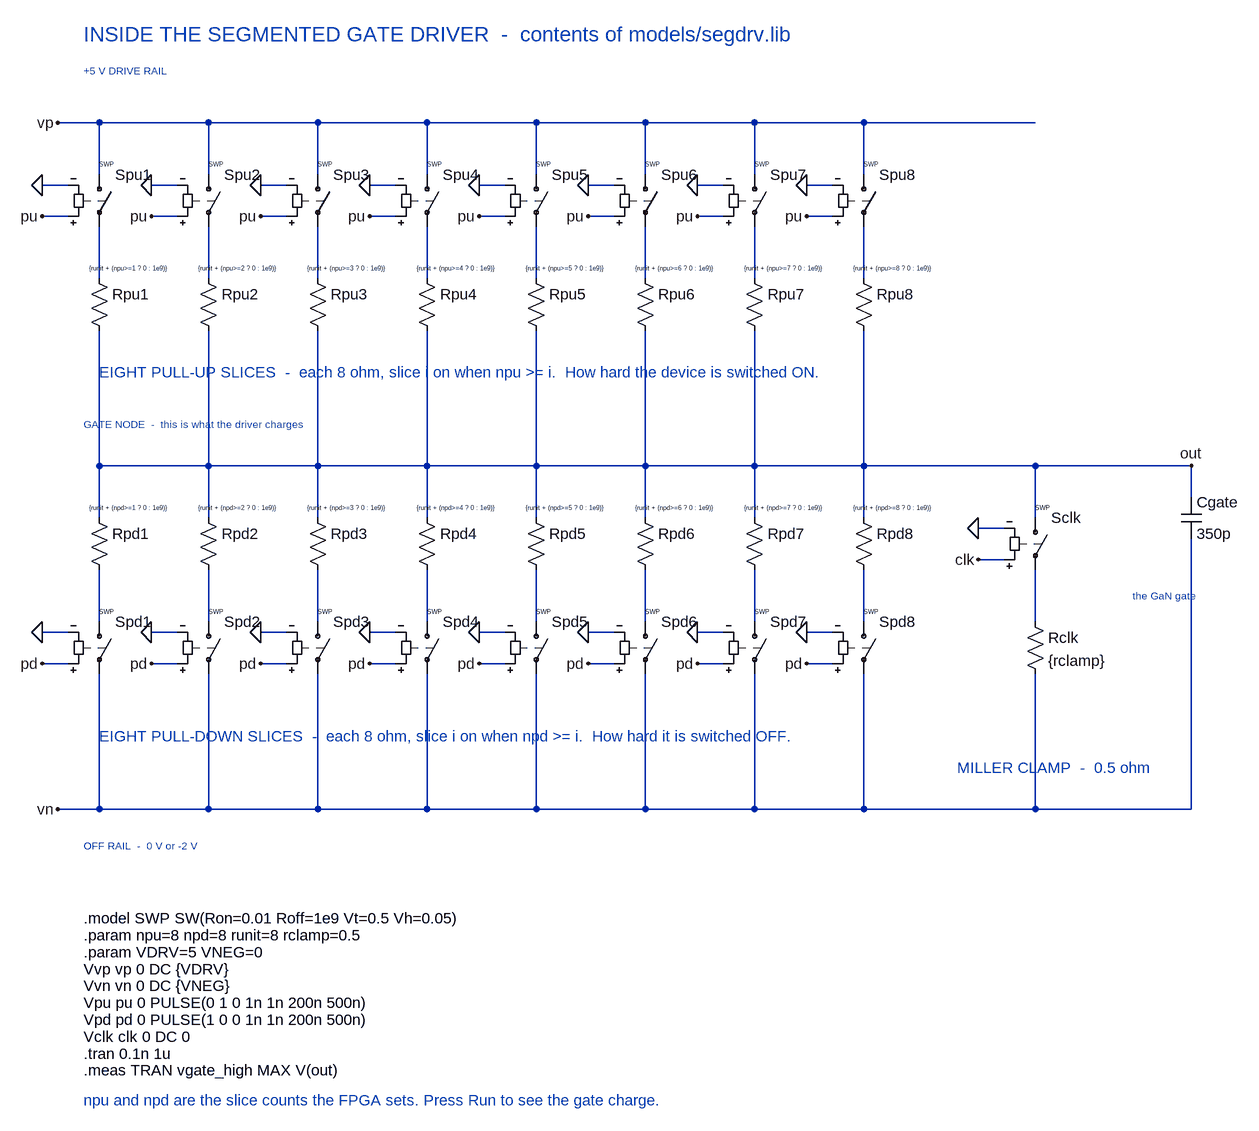
[diagram p0: schematic SEGDRV_inside.asc]
SEGDRV_inside.asc, the LTspice schematic file:
Version 4
SHEET 1 2600 1800
SYMBOL sw 224 240 R0
WINDOW 3 0 0 Left 0
SYMATTR InstName Spu1
SYMATTR Value SWP
SYMBOL res 208 400 R0
WINDOW 3 0 0 Left 0
SYMATTR InstName Rpu1
SYMATTR Value {runit + (npu>=1 ? 0 : 1e9)}
WIRE 224 176 224 256
WIRE 224 336 224 416
WIRE 224 496 224 704
WIRE 176 320 136 320
FLAG 136 320 pu
WIRE 176 272 136 272
FLAG 136 272 0
SYMBOL sw 392 240 R0
WINDOW 3 0 0 Left 0
SYMATTR InstName Spu2
SYMATTR Value SWP
SYMBOL res 376 400 R0
WINDOW 3 0 0 Left 0
SYMATTR InstName Rpu2
SYMATTR Value {runit + (npu>=2 ? 0 : 1e9)}
WIRE 392 176 392 256
WIRE 392 336 392 416
WIRE 392 496 392 704
WIRE 344 320 304 320
FLAG 304 320 pu
WIRE 344 272 304 272
FLAG 304 272 0
SYMBOL sw 560 240 R0
WINDOW 3 0 0 Left 0
SYMATTR InstName Spu3
SYMATTR Value SWP
SYMBOL res 544 400 R0
WINDOW 3 0 0 Left 0
SYMATTR InstName Rpu3
SYMATTR Value {runit + (npu>=3 ? 0 : 1e9)}
WIRE 560 176 560 256
WIRE 560 336 560 416
WIRE 560 496 560 704
WIRE 512 320 472 320
FLAG 472 320 pu
WIRE 512 272 472 272
FLAG 472 272 0
SYMBOL sw 728 240 R0
WINDOW 3 0 0 Left 0
SYMATTR InstName Spu4
SYMATTR Value SWP
SYMBOL res 712 400 R0
WINDOW 3 0 0 Left 0
SYMATTR InstName Rpu4
SYMATTR Value {runit + (npu>=4 ? 0 : 1e9)}
WIRE 728 176 728 256
WIRE 728 336 728 416
WIRE 728 496 728 704
WIRE 680 320 640 320
FLAG 640 320 pu
WIRE 680 272 640 272
FLAG 640 272 0
SYMBOL sw 896 240 R0
WINDOW 3 0 0 Left 0
SYMATTR InstName Spu5
SYMATTR Value SWP
SYMBOL res 880 400 R0
WINDOW 3 0 0 Left 0
SYMATTR InstName Rpu5
SYMATTR Value {runit + (npu>=5 ? 0 : 1e9)}
WIRE 896 176 896 256
WIRE 896 336 896 416
WIRE 896 496 896 704
WIRE 848 320 808 320
FLAG 808 320 pu
WIRE 848 272 808 272
FLAG 808 272 0
SYMBOL sw 1064 240 R0
WINDOW 3 0 0 Left 0
SYMATTR InstName Spu6
SYMATTR Value SWP
SYMBOL res 1048 400 R0
WINDOW 3 0 0 Left 0
SYMATTR InstName Rpu6
SYMATTR Value {runit + (npu>=6 ? 0 : 1e9)}
WIRE 1064 176 1064 256
WIRE 1064 336 1064 416
WIRE 1064 496 1064 704
WIRE 1016 320 976 320
FLAG 976 320 pu
WIRE 1016 272 976 272
FLAG 976 272 0
SYMBOL sw 1232 240 R0
WINDOW 3 0 0 Left 0
SYMATTR InstName Spu7
SYMATTR Value SWP
SYMBOL res 1216 400 R0
WINDOW 3 0 0 Left 0
SYMATTR InstName Rpu7
SYMATTR Value {runit + (npu>=7 ? 0 : 1e9)}
WIRE 1232 176 1232 256
WIRE 1232 336 1232 416
WIRE 1232 496 1232 704
WIRE 1184 320 1144 320
FLAG 1144 320 pu
WIRE 1184 272 1144 272
FLAG 1144 272 0
SYMBOL sw 1400 240 R0
WINDOW 3 0 0 Left 0
SYMATTR InstName Spu8
SYMATTR Value SWP
SYMBOL res 1384 400 R0
WINDOW 3 0 0 Left 0
SYMATTR InstName Rpu8
SYMATTR Value {runit + (npu>=8 ? 0 : 1e9)}
WIRE 1400 176 1400 256
WIRE 1400 336 1400 416
WIRE 1400 496 1400 704
WIRE 1352 320 1312 320
FLAG 1312 320 pu
WIRE 1352 272 1312 272
FLAG 1312 272 0
SYMBOL res 208 768 R0
WINDOW 3 0 0 Left 0
SYMATTR InstName Rpd1
SYMATTR Value {runit + (npd>=1 ? 0 : 1e9)}
SYMBOL sw 224 928 R0
WINDOW 3 0 0 Left 0
SYMATTR InstName Spd1
SYMATTR Value SWP
WIRE 224 704 224 784
WIRE 224 864 224 944
WIRE 224 1024 224 1232
WIRE 176 1008 136 1008
FLAG 136 1008 pd
WIRE 176 960 136 960
FLAG 136 960 0
SYMBOL res 376 768 R0
WINDOW 3 0 0 Left 0
SYMATTR InstName Rpd2
SYMATTR Value {runit + (npd>=2 ? 0 : 1e9)}
SYMBOL sw 392 928 R0
WINDOW 3 0 0 Left 0
SYMATTR InstName Spd2
SYMATTR Value SWP
WIRE 392 704 392 784
WIRE 392 864 392 944
WIRE 392 1024 392 1232
WIRE 344 1008 304 1008
FLAG 304 1008 pd
WIRE 344 960 304 960
FLAG 304 960 0
SYMBOL res 544 768 R0
WINDOW 3 0 0 Left 0
SYMATTR InstName Rpd3
SYMATTR Value {runit + (npd>=3 ? 0 : 1e9)}
SYMBOL sw 560 928 R0
WINDOW 3 0 0 Left 0
SYMATTR InstName Spd3
SYMATTR Value SWP
WIRE 560 704 560 784
WIRE 560 864 560 944
WIRE 560 1024 560 1232
WIRE 512 1008 472 1008
FLAG 472 1008 pd
WIRE 512 960 472 960
FLAG 472 960 0
SYMBOL res 712 768 R0
WINDOW 3 0 0 Left 0
SYMATTR InstName Rpd4
SYMATTR Value {runit + (npd>=4 ? 0 : 1e9)}
SYMBOL sw 728 928 R0
WINDOW 3 0 0 Left 0
SYMATTR InstName Spd4
SYMATTR Value SWP
WIRE 728 704 728 784
WIRE 728 864 728 944
WIRE 728 1024 728 1232
WIRE 680 1008 640 1008
FLAG 640 1008 pd
WIRE 680 960 640 960
FLAG 640 960 0
SYMBOL res 880 768 R0
WINDOW 3 0 0 Left 0
SYMATTR InstName Rpd5
SYMATTR Value {runit + (npd>=5 ? 0 : 1e9)}
SYMBOL sw 896 928 R0
WINDOW 3 0 0 Left 0
SYMATTR InstName Spd5
SYMATTR Value SWP
WIRE 896 704 896 784
WIRE 896 864 896 944
WIRE 896 1024 896 1232
WIRE 848 1008 808 1008
FLAG 808 1008 pd
WIRE 848 960 808 960
FLAG 808 960 0
SYMBOL res 1048 768 R0
WINDOW 3 0 0 Left 0
SYMATTR InstName Rpd6
SYMATTR Value {runit + (npd>=6 ? 0 : 1e9)}
SYMBOL sw 1064 928 R0
WINDOW 3 0 0 Left 0
SYMATTR InstName Spd6
SYMATTR Value SWP
WIRE 1064 704 1064 784
WIRE 1064 864 1064 944
WIRE 1064 1024 1064 1232
WIRE 1016 1008 976 1008
FLAG 976 1008 pd
WIRE 1016 960 976 960
FLAG 976 960 0
SYMBOL res 1216 768 R0
WINDOW 3 0 0 Left 0
SYMATTR InstName Rpd7
SYMATTR Value {runit + (npd>=7 ? 0 : 1e9)}
SYMBOL sw 1232 928 R0
WINDOW 3 0 0 Left 0
SYMATTR InstName Spd7
SYMATTR Value SWP
WIRE 1232 704 1232 784
WIRE 1232 864 1232 944
WIRE 1232 1024 1232 1232
WIRE 1184 1008 1144 1008
FLAG 1144 1008 pd
WIRE 1184 960 1144 960
FLAG 1144 960 0
SYMBOL res 1384 768 R0
WINDOW 3 0 0 Left 0
SYMATTR InstName Rpd8
SYMATTR Value {runit + (npd>=8 ? 0 : 1e9)}
SYMBOL sw 1400 928 R0
WINDOW 3 0 0 Left 0
SYMATTR InstName Spd8
SYMATTR Value SWP
WIRE 1400 704 1400 784
WIRE 1400 864 1400 944
WIRE 1400 1024 1400 1232
WIRE 1352 1008 1312 1008
FLAG 1312 1008 pd
WIRE 1352 960 1312 960
FLAG 1312 960 0
SYMBOL sw 1664 768 R0
WINDOW 3 0 0 Left 0
SYMATTR InstName Sclk
SYMATTR Value SWP
SYMBOL res 1648 928 R0
SYMATTR InstName Rclk
SYMATTR Value {rclamp}
WIRE 1664 704 1664 784
WIRE 1664 864 1664 944
WIRE 1664 1024 1664 1232
WIRE 1616 848 1576 848
FLAG 1576 848 clk
WIRE 1616 800 1576 800
FLAG 1576 800 0
WIRE 224 176 1664 176
WIRE 224 704 1664 704
WIRE 224 1232 1664 1232
FLAG 160 176 vp
WIRE 160 176 224 176
FLAG 160 1232 vn
WIRE 160 1232 224 1232
WIRE 1664 704 1904 704
FLAG 1904 704 out
SYMBOL cap 1888 752 R0
SYMATTR InstName Cgate
SYMATTR Value 350p
WIRE 1904 704 1904 752
WIRE 1904 816 1904 1232
WIRE 1904 1232 1664 1232
TEXT 200 96 Left 1 ;+5 V DRIVE RAIL
TEXT 200 640 Left 1 ;GATE NODE  -  this is what the driver charges
TEXT 200 1288 Left 1 ;OFF RAIL  -  0 V or -2 V
TEXT 200 40 Left 3 ;INSIDE THE SEGMENTED GATE DRIVER  -  contents of models/segdrv.lib
TEXT 224 560 Left 2 ;EIGHT PULL-UP SLICES  -  each 8 ohm, slice i on when npu >= i.  How hard the device is switched ON.
TEXT 224 1120 Left 2 ;EIGHT PULL-DOWN SLICES  -  each 8 ohm, slice i on when npd >= i.  How hard it is switched OFF.
TEXT 1544 1168 Left 2 ;MILLER CLAMP  -  0.5 ohm
TEXT 1814 904 Left 1 ;the GaN gate
TEXT 200 1400 Left 2 !.model SWP SW(Ron=0.01 Roff=1e9 Vt=0.5 Vh=0.05)
TEXT 200 1426 Left 2 !.param npu=8 npd=8 runit=8 rclamp=0.5
TEXT 200 1452 Left 2 !.param VDRV=5 VNEG=0
TEXT 200 1478 Left 2 !Vvp vp 0 DC {VDRV}
TEXT 200 1504 Left 2 !Vvn vn 0 DC {VNEG}
TEXT 200 1530 Left 2 !Vpu pu 0 PULSE(0 1 0 1n 1n 200n 500n)
TEXT 200 1556 Left 2 !Vpd pd 0 PULSE(1 0 0 1n 1n 200n 500n)
TEXT 200 1582 Left 2 !Vclk clk 0 DC 0
TEXT 200 1608 Left 2 !.tran 0.1n 1u
TEXT 200 1634 Left 2 !.meas TRAN vgate_high MAX V(out)
TEXT 200 1680 Left 2 ;npu and npd are the slice counts the FPGA sets. Press Run to see the gate charge.

The netlist it stands for:
* SEGDRV_inside.asc
Spu1 vp N001 pu 0 SWP
Rpu1 N001 out {runit + (npu>=1 ? 0 : 1e9)}
Spu2 vp N002 pu 0 SWP
Rpu2 N002 out {runit + (npu>=2 ? 0 : 1e9)}
Spu3 vp N003 pu 0 SWP
Rpu3 N003 out {runit + (npu>=3 ? 0 : 1e9)}
Spu4 vp N004 pu 0 SWP
Rpu4 N004 out {runit + (npu>=4 ? 0 : 1e9)}
Spu5 vp N005 pu 0 SWP
Rpu5 N005 out {runit + (npu>=5 ? 0 : 1e9)}
Spu6 vp N006 pu 0 SWP
Rpu6 N006 out {runit + (npu>=6 ? 0 : 1e9)}
Spu7 vp N007 pu 0 SWP
Rpu7 N007 out {runit + (npu>=7 ? 0 : 1e9)}
Spu8 vp N008 pu 0 SWP
Rpu8 N008 out {runit + (npu>=8 ? 0 : 1e9)}
Rpd1 out N009 {runit + (npd>=1 ? 0 : 1e9)}
Spd1 N009 vn pd 0 SWP
Rpd2 out N010 {runit + (npd>=2 ? 0 : 1e9)}
Spd2 N010 vn pd 0 SWP
Rpd3 out N011 {runit + (npd>=3 ? 0 : 1e9)}
Spd3 N011 vn pd 0 SWP
Rpd4 out N012 {runit + (npd>=4 ? 0 : 1e9)}
Spd4 N012 vn pd 0 SWP
Rpd5 out N013 {runit + (npd>=5 ? 0 : 1e9)}
Spd5 N013 vn pd 0 SWP
Rpd6 out N014 {runit + (npd>=6 ? 0 : 1e9)}
Spd6 N014 vn pd 0 SWP
Rpd7 out N015 {runit + (npd>=7 ? 0 : 1e9)}
Spd7 N015 vn pd 0 SWP
Rpd8 out N016 {runit + (npd>=8 ? 0 : 1e9)}
Spd8 N016 vn pd 0 SWP
Sclk out N017 clk 0 SWP
Rclk N017 vn {rclamp}
Cgate out vn 350p
* +5 V DRIVE RAIL
* GATE NODE  -  this is what the driver charges
* OFF RAIL  -  0 V or -2 V
* INSIDE THE SEGMENTED GATE DRIVER  -  contents of models/segdrv.lib
* EIGHT PULL-UP SLICES  -  each 8 ohm, slice i on when npu >= i.  How hard the device is switched ON.
* EIGHT PULL-DOWN SLICES  -  each 8 ohm, slice i on when npd >= i.  How hard it is switched OFF.
* MILLER CLAMP  -  0.5 ohm
* the GaN gate
.model SWP SW(Ron=0.01 Roff=1e9 Vt=0.5 Vh=0.05)
.param npu=8 npd=8 runit=8 rclamp=0.5
.param VDRV=5 VNEG=0
Vvp vp 0 DC {VDRV}
Vvn vn 0 DC {VNEG}
Vpu pu 0 PULSE(0 1 0 1n 1n 200n 500n)
Vpd pd 0 PULSE(1 0 0 1n 1n 200n 500n)
Vclk clk 0 DC 0
.tran 0.1n 1u
.meas TRAN vgate_high MAX V(out)
* npu and npd are the slice counts the FPGA sets. Press Run to see the gate charge.
.backanno
.end